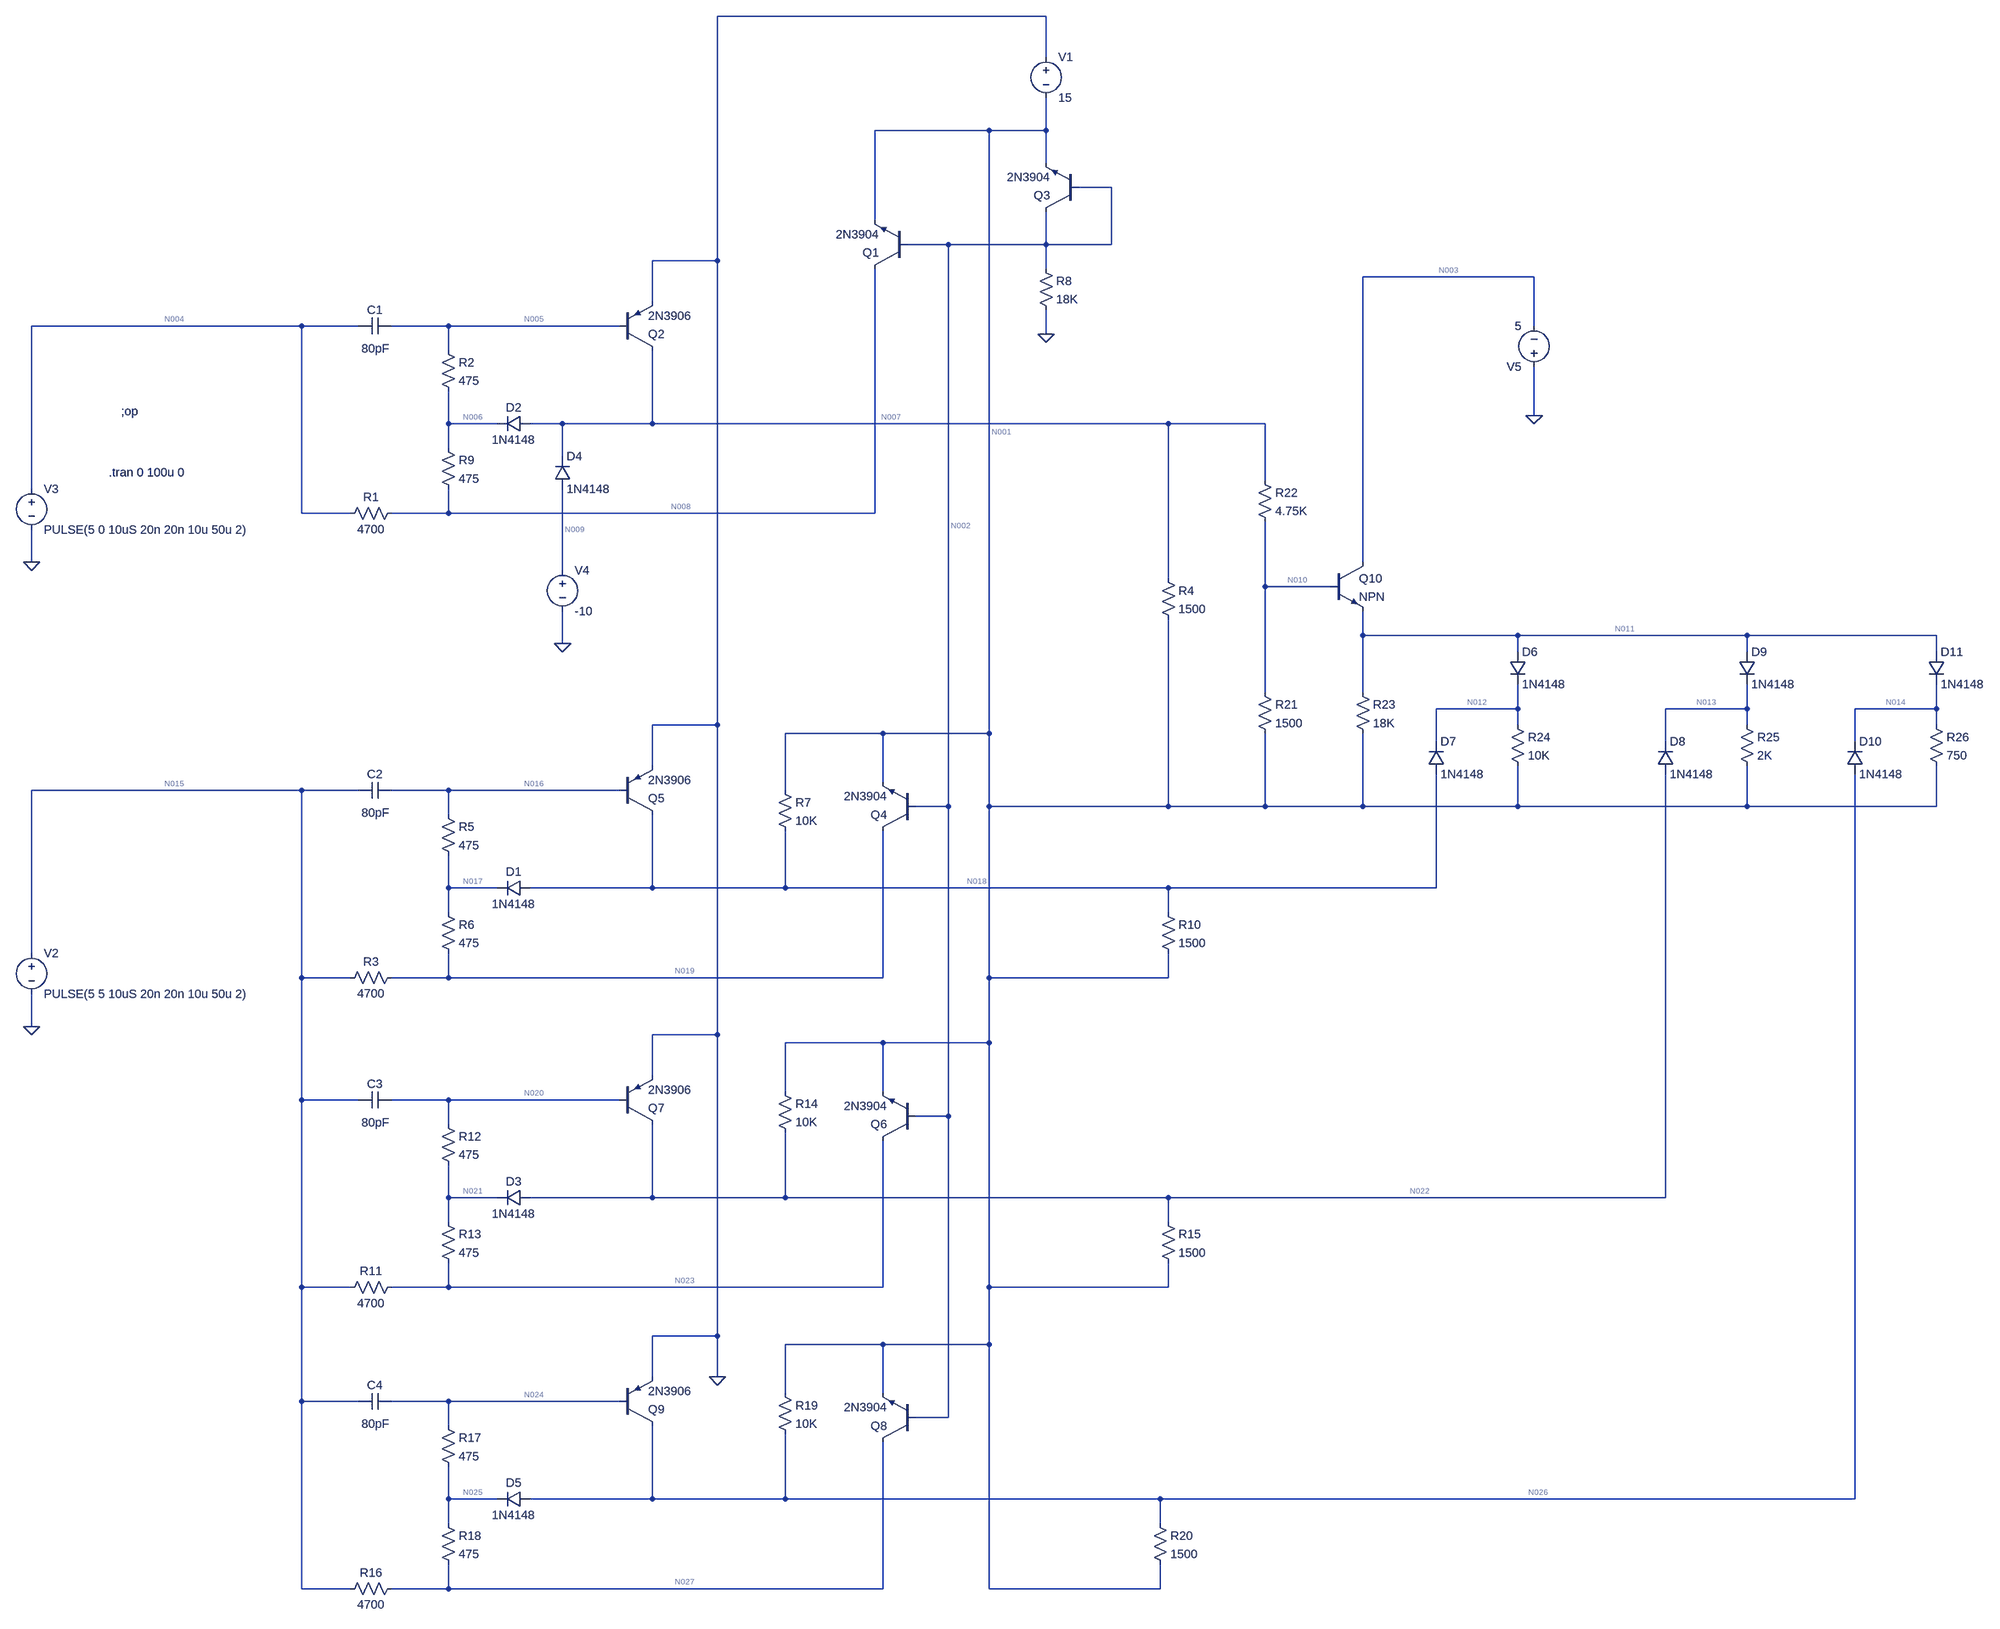
[diagram p0: schematic contra1579.asc]
contra1579.asc, the LTspice schematic file:
Version 4
SHEET 1 3744 3028
WIRE 1232 -784 512 -784
WIRE 1232 -704 1232 -784
WIRE 1120 -560 896 -560
WIRE 1232 -560 1232 -624
WIRE 1232 -560 1120 -560
WIRE 1232 -496 1232 -560
WIRE 1360 -448 1296 -448
WIRE 896 -384 896 -560
WIRE 1040 -336 960 -336
WIRE 1232 -336 1232 -400
WIRE 1232 -336 1040 -336
WIRE 1360 -336 1360 -448
WIRE 1360 -336 1232 -336
WIRE 512 -304 512 -784
WIRE 512 -304 384 -304
WIRE 1232 -288 1232 -336
WIRE 2208 -272 1872 -272
WIRE 384 -224 384 -304
WIRE -304 -176 -864 -176
WIRE -192 -176 -304 -176
WIRE -16 -176 -128 -176
WIRE 320 -176 -16 -176
WIRE 2208 -176 2208 -272
WIRE 1232 -160 1232 -208
WIRE -16 -128 -16 -176
WIRE 2208 0 2208 -96
WIRE -16 16 -16 -48
WIRE 80 16 -16 16
WIRE 208 16 144 16
WIRE 384 16 384 -128
WIRE 384 16 208 16
WIRE 1472 16 384 16
WIRE 1680 16 1472 16
WIRE -16 64 -16 16
WIRE 208 80 208 16
WIRE 1680 128 1680 16
WIRE -864 144 -864 -176
WIRE -304 192 -304 -176
WIRE -208 192 -304 192
WIRE -16 192 -16 144
WIRE -16 192 -128 192
WIRE 896 192 896 -288
WIRE 896 192 -16 192
WIRE -864 288 -864 224
WIRE 1872 288 1872 -272
WIRE 208 304 208 144
WIRE 1472 320 1472 16
WIRE 1680 336 1680 208
WIRE 1808 336 1680 336
WIRE 1872 432 1872 384
WIRE 2176 432 1872 432
WIRE 2656 432 2176 432
WIRE 3136 432 2656 432
WIRE 208 448 208 384
WIRE 2176 464 2176 432
WIRE 2656 464 2656 432
WIRE 3136 464 3136 432
WIRE 1680 544 1680 336
WIRE 1872 544 1872 432
WIRE 2176 576 2176 528
WIRE 2176 576 2016 576
WIRE 2656 576 2656 528
WIRE 2656 576 2496 576
WIRE 3136 576 3136 528
WIRE 3136 576 2976 576
WIRE 512 608 512 -304
WIRE 512 608 384 608
WIRE 2176 608 2176 576
WIRE 2656 608 2656 576
WIRE 3136 608 3136 576
WIRE 912 624 720 624
WIRE 1120 624 1120 -560
WIRE 1120 624 912 624
WIRE 2016 640 2016 576
WIRE 2496 640 2496 576
WIRE 2976 640 2976 576
WIRE 384 688 384 608
WIRE 912 720 912 624
WIRE -304 736 -864 736
WIRE -192 736 -304 736
WIRE -16 736 -128 736
WIRE 320 736 -16 736
WIRE 720 736 720 624
WIRE 1040 768 1040 -336
WIRE 1040 768 976 768
WIRE 1120 768 1120 624
WIRE 1472 768 1472 400
WIRE 1472 768 1120 768
WIRE 1680 768 1680 624
WIRE 1680 768 1472 768
WIRE 1872 768 1872 624
WIRE 1872 768 1680 768
WIRE 2176 768 2176 688
WIRE 2176 768 1872 768
WIRE 2656 768 2656 688
WIRE 2656 768 2176 768
WIRE 3136 768 3136 688
WIRE 3136 768 2656 768
WIRE -16 784 -16 736
WIRE -16 928 -16 864
WIRE 80 928 -16 928
WIRE 384 928 384 784
WIRE 384 928 144 928
WIRE 720 928 720 816
WIRE 720 928 384 928
WIRE 1472 928 720 928
WIRE 2016 928 2016 704
WIRE 2016 928 1472 928
WIRE -16 976 -16 928
WIRE 1472 976 1472 928
WIRE -864 1056 -864 736
WIRE -304 1104 -304 736
WIRE -208 1104 -304 1104
WIRE -16 1104 -16 1056
WIRE -16 1104 -128 1104
WIRE 912 1104 912 816
WIRE 912 1104 -16 1104
WIRE 1120 1104 1120 768
WIRE 1472 1104 1472 1056
WIRE 1472 1104 1120 1104
WIRE -864 1200 -864 1136
WIRE 512 1216 512 608
WIRE 512 1216 384 1216
WIRE 912 1232 720 1232
WIRE 1120 1232 1120 1104
WIRE 1120 1232 912 1232
WIRE 384 1296 384 1216
WIRE 720 1328 720 1232
WIRE 912 1328 912 1232
WIRE -304 1344 -304 1104
WIRE -192 1344 -304 1344
WIRE -16 1344 -128 1344
WIRE 320 1344 -16 1344
WIRE 1040 1376 1040 768
WIRE 1040 1376 976 1376
WIRE -16 1392 -16 1344
WIRE -16 1536 -16 1472
WIRE 80 1536 -16 1536
WIRE 384 1536 384 1392
WIRE 384 1536 144 1536
WIRE 720 1536 720 1408
WIRE 720 1536 384 1536
WIRE 1472 1536 720 1536
WIRE 2496 1536 2496 704
WIRE 2496 1536 1472 1536
WIRE -16 1584 -16 1536
WIRE 1472 1584 1472 1536
WIRE -304 1712 -304 1344
WIRE -208 1712 -304 1712
WIRE -16 1712 -16 1664
WIRE -16 1712 -128 1712
WIRE 912 1712 912 1424
WIRE 912 1712 -16 1712
WIRE 1120 1712 1120 1232
WIRE 1472 1712 1472 1664
WIRE 1472 1712 1120 1712
WIRE 512 1808 512 1216
WIRE 512 1808 384 1808
WIRE 912 1824 720 1824
WIRE 1120 1824 1120 1712
WIRE 1120 1824 912 1824
WIRE 384 1888 384 1808
WIRE 512 1888 512 1808
WIRE 720 1920 720 1824
WIRE 912 1920 912 1824
WIRE -304 1936 -304 1712
WIRE -192 1936 -304 1936
WIRE -16 1936 -128 1936
WIRE 320 1936 -16 1936
WIRE 1040 1968 1040 1376
WIRE 1040 1968 976 1968
WIRE -16 1984 -16 1936
WIRE -16 2128 -16 2064
WIRE 80 2128 -16 2128
WIRE 384 2128 384 1984
WIRE 384 2128 144 2128
WIRE 720 2128 720 2000
WIRE 720 2128 384 2128
WIRE 1456 2128 720 2128
WIRE 2976 2128 2976 704
WIRE 2976 2128 1456 2128
WIRE -16 2176 -16 2128
WIRE 1456 2176 1456 2128
WIRE -304 2304 -304 1936
WIRE -208 2304 -304 2304
WIRE -16 2304 -16 2256
WIRE -16 2304 -128 2304
WIRE 912 2304 912 2016
WIRE 912 2304 -16 2304
WIRE 1120 2304 1120 1824
WIRE 1456 2304 1456 2256
WIRE 1456 2304 1120 2304
FLAG -864 288 0
FLAG 1232 -160 0
FLAG 208 448 0
FLAG -864 1200 0
FLAG 512 1888 0
FLAG 2208 0 0
DATAFLAG 800 192 ""
SYMBOL cap -128 -192 R90
WINDOW 0 0 32 VBottom 2
WINDOW 3 45 31 VTop 2
SYMATTR InstName C1
SYMATTR Value 80pF
SYMBOL pnp 320 -128 M180
SYMATTR InstName Q2
SYMATTR Value 2N3906
SYMBOL voltage 1232 -720 R0
WINDOW 123 0 0 Left 2
WINDOW 39 0 0 Left 2
SYMATTR InstName V1
SYMATTR Value 15
SYMBOL voltage -864 128 R0
WINDOW 123 0 0 Left 2
WINDOW 39 0 0 Left 2
SYMATTR InstName V3
SYMATTR Value PULSE(5 0 10uS 20n 20n 10u 50u 2)
SYMBOL res 1216 -304 R0
SYMATTR InstName R8
SYMATTR Value 18K
SYMBOL res -112 176 R90
WINDOW 0 0 56 VBottom 2
WINDOW 3 32 56 VTop 2
SYMATTR InstName R1
SYMATTR Value 4700
SYMBOL res -32 -144 R0
SYMATTR InstName R2
SYMATTR Value 475
SYMBOL res -32 48 R0
SYMATTR InstName R9
SYMATTR Value 475
SYMBOL diode 144 32 M270
WINDOW 0 32 32 VTop 2
WINDOW 3 0 32 VBottom 2
SYMATTR InstName D2
SYMATTR Value 1N4148
SYMBOL diode 192 144 M180
WINDOW 0 24 64 Left 2
WINDOW 3 24 0 Left 2
SYMATTR InstName D4
SYMATTR Value 1N4148
SYMBOL voltage 208 288 R0
WINDOW 123 0 0 Left 2
WINDOW 39 0 0 Left 2
SYMATTR InstName V4
SYMATTR Value -10
SYMBOL npn 960 -288 R180
SYMATTR InstName Q1
SYMATTR Value 2N3904
SYMBOL npn 1296 -400 R180
SYMATTR InstName Q3
SYMATTR Value 2N3904
SYMBOL npn 976 816 R180
SYMATTR InstName Q4
SYMATTR Value 2N3904
SYMBOL cap -128 720 R90
WINDOW 0 0 32 VBottom 2
WINDOW 3 45 31 VTop 2
SYMATTR InstName C2
SYMATTR Value 80pF
SYMBOL voltage -864 1040 R0
WINDOW 123 0 0 Left 2
WINDOW 39 0 0 Left 2
SYMATTR InstName V2
SYMATTR Value PULSE(5 5 10uS 20n 20n 10u 50u 2)
SYMBOL res -112 1088 R90
WINDOW 0 0 56 VBottom 2
WINDOW 3 32 56 VTop 2
SYMATTR InstName R3
SYMATTR Value 4700
SYMBOL res -32 768 R0
SYMATTR InstName R5
SYMATTR Value 475
SYMBOL res -32 960 R0
SYMATTR InstName R6
SYMATTR Value 475
SYMBOL diode 144 944 M270
WINDOW 0 32 32 VTop 2
WINDOW 3 0 32 VBottom 2
SYMATTR InstName D1
SYMATTR Value 1N4148
SYMBOL pnp 320 784 M180
SYMATTR InstName Q5
SYMATTR Value 2N3906
SYMBOL res 704 720 R0
SYMATTR InstName R7
SYMATTR Value 10K
SYMBOL res 1456 960 R0
SYMATTR InstName R10
SYMATTR Value 1500
SYMBOL npn 976 1424 R180
SYMATTR InstName Q6
SYMATTR Value 2N3904
SYMBOL cap -128 1328 R90
WINDOW 0 0 32 VBottom 2
WINDOW 3 45 31 VTop 2
SYMATTR InstName C3
SYMATTR Value 80pF
SYMBOL res -112 1696 R90
WINDOW 0 0 56 VBottom 2
WINDOW 3 32 56 VTop 2
SYMATTR InstName R11
SYMATTR Value 4700
SYMBOL res -32 1376 R0
SYMATTR InstName R12
SYMATTR Value 475
SYMBOL res -32 1568 R0
SYMATTR InstName R13
SYMATTR Value 475
SYMBOL diode 144 1552 M270
WINDOW 0 32 32 VTop 2
WINDOW 3 0 32 VBottom 2
SYMATTR InstName D3
SYMATTR Value 1N4148
SYMBOL pnp 320 1392 M180
SYMATTR InstName Q7
SYMATTR Value 2N3906
SYMBOL res 704 1312 R0
SYMATTR InstName R14
SYMATTR Value 10K
SYMBOL res 1456 1568 R0
SYMATTR InstName R15
SYMATTR Value 1500
SYMBOL npn 976 2016 R180
SYMATTR InstName Q8
SYMATTR Value 2N3904
SYMBOL cap -128 1920 R90
WINDOW 0 0 32 VBottom 2
WINDOW 3 45 31 VTop 2
SYMATTR InstName C4
SYMATTR Value 80pF
SYMBOL res -112 2288 R90
WINDOW 0 0 56 VBottom 2
WINDOW 3 32 56 VTop 2
SYMATTR InstName R16
SYMATTR Value 4700
SYMBOL res -32 1968 R0
SYMATTR InstName R17
SYMATTR Value 475
SYMBOL res -32 2160 R0
SYMATTR InstName R18
SYMATTR Value 475
SYMBOL diode 144 2144 M270
WINDOW 0 32 32 VTop 2
WINDOW 3 0 32 VBottom 2
SYMATTR InstName D5
SYMATTR Value 1N4148
SYMBOL pnp 320 1984 M180
SYMATTR InstName Q9
SYMATTR Value 2N3906
SYMBOL res 704 1904 R0
SYMATTR InstName R19
SYMATTR Value 10K
SYMBOL res 1440 2160 R0
SYMATTR InstName R20
SYMATTR Value 1500
SYMBOL npn 1808 288 R0
SYMATTR InstName Q10
SYMBOL res 1664 528 R0
SYMATTR InstName R21
SYMATTR Value 1500
SYMBOL res 1664 112 R0
SYMATTR InstName R22
SYMATTR Value 4.75K
SYMBOL res 1456 304 R0
SYMATTR InstName R4
SYMATTR Value 1500
SYMBOL res 1856 528 R0
SYMATTR InstName R23
SYMATTR Value 18K
SYMBOL voltage 2208 -80 R180
WINDOW 123 0 0 Left 2
WINDOW 39 0 0 Left 2
SYMATTR InstName V5
SYMATTR Value 5
SYMBOL diode 2160 464 R0
SYMATTR InstName D6
SYMATTR Value 1N4148
SYMBOL res 2160 592 R0
SYMATTR InstName R24
SYMATTR Value 10K
SYMBOL diode 2000 704 M180
WINDOW 0 24 64 Left 2
WINDOW 3 24 0 Left 2
SYMATTR InstName D7
SYMATTR Value 1N4148
SYMBOL res 2640 592 R0
SYMATTR InstName R25
SYMATTR Value 2K
SYMBOL diode 2480 704 M180
WINDOW 0 24 64 Left 2
WINDOW 3 24 0 Left 2
SYMATTR InstName D8
SYMATTR Value 1N4148
SYMBOL diode 2640 464 R0
SYMATTR InstName D9
SYMATTR Value 1N4148
SYMBOL res 3120 592 R0
SYMATTR InstName R26
SYMATTR Value 750
SYMBOL diode 2960 704 M180
WINDOW 0 24 64 Left 2
WINDOW 3 24 0 Left 2
SYMATTR InstName D10
SYMATTR Value 1N4148
SYMBOL diode 3120 464 R0
SYMATTR InstName D11
SYMATTR Value 1N4148
TEXT -688 -8 Left 2 !;op
TEXT -712 112 Left 2 !.tran 0 100u 0

The netlist it stands for:
* contra1579.asc
C1 N005 N004 80pF
Q2 N007 N005 0 0 2N3906
V1 0 N001 15
V3 N004 0 PULSE(5 0 10uS 20n 20n 10u 50u 2)
R8 N002 0 18K
R1 N008 N004 4700
R2 N005 N006 475
R9 N006 N008 475
D2 N007 N006 1N4148
D4 N009 N007 1N4148
V4 N009 0 -10
Q1 N008 N002 N001 0 2N3904
Q3 N002 N002 N001 0 2N3904
Q4 N019 N002 N001 0 2N3904
C2 N016 N015 80pF
V2 N015 0 PULSE(5 5 10uS 20n 20n 10u 50u 2)
R3 N019 N015 4700
R5 N016 N017 475
R6 N017 N019 475
D1 N018 N017 1N4148
Q5 N018 N016 0 0 2N3906
R7 N001 N018 10K
R10 N018 N001 1500
Q6 N023 N002 N001 0 2N3904
C3 N020 N015 80pF
R11 N023 N015 4700
R12 N020 N021 475
R13 N021 N023 475
D3 N022 N021 1N4148
Q7 N022 N020 0 0 2N3906
R14 N001 N022 10K
R15 N022 N001 1500
Q8 N027 N002 N001 0 2N3904
C4 N024 N015 80pF
R16 N027 N015 4700
R17 N024 N025 475
R18 N025 N027 475
D5 N026 N025 1N4148
Q9 N026 N024 0 0 2N3906
R19 N001 N026 10K
R20 N026 N001 1500
Q10 N003 N010 N011 0 NPN
R21 N010 N001 1500
R22 N007 N010 4.75K
R4 N007 N001 1500
R23 N011 N001 18K
V5 0 N003 5
D6 N011 N012 1N4148
R24 N012 N001 10K
D7 N018 N012 1N4148
R25 N013 N001 2K
D8 N022 N013 1N4148
D9 N011 N013 1N4148
R26 N014 N001 750
D10 N026 N014 1N4148
D11 N011 N014 1N4148
.model D D
.lib standard.dio
.model NPN NPN
.model PNP PNP
.lib standard.bjt
;op
.tran 0 100u 0
.backanno
.end

* Results of the author's LTspice run, read from the files saved beside the schematic
* Operating Point, zero values left out:
*   V(n005) = 759.3 mV
*   V(n004) = 5 V
*   V(n007) = -10.64 V
*   V(n001) = -15 V
*   V(n002) = -14.35 V
*   V(n008) = 759.3 mV
*   V(n006) = 759.3 mV
*   V(n009) = -10 V
*   V(n019) = 759.3 mV
*   V(n016) = 759.3 mV
*   V(n015) = 5 V
*   V(n017) = 759.3 mV
*   V(n018) = -15 V
*   V(n023) = 759.3 mV
*   V(n020) = 759.3 mV
*   V(n021) = 759.3 mV
*   V(n022) = -15 V
*   V(n027) = 759.3 mV
*   V(n024) = 759.3 mV
*   V(n025) = 759.3 mV
*   V(n026) = -15 V
*   V(n003) = -5 V
*   V(n010) = -13.96 V
*   V(n011) = -14.64 V
*   V(n012) = -14.97 V
*   V(n013) = -14.99 V
*   V(n014) = -15 V
*   Ic(Q10) = 34.32 µA
*   Ib(Q10) = 343.2 nA
*   Ie(Q10) = -34.67 µA
*   Ic(Q8) = 902.3 µA
*   Ib(Q8) = 2.618 µA
*   Ie(Q8) = -904.9 µA
*   Ic(Q6) = 902.3 µA
*   Ib(Q6) = 2.618 µA
*   Ie(Q6) = -904.9 µA
*   Ic(Q4) = 902.3 µA
*   Ib(Q4) = 2.618 µA
*   Ie(Q4) = -904.9 µA
*   Ic(Q3) = 784.2 µA
*   Ib(Q3) = 2.619 µA
*   Ie(Q3) = -786.8 µA
*   Ic(Q1) = 902.3 µA
*   Ib(Q1) = 2.618 µA
*   Ie(Q1) = -904.9 µA
*   Ic(Q9) = -15.77 pA
*   Ib(Q9) = 16.52 pA
*   Ic(Q7) = -15.77 pA
*   Ib(Q7) = 16.52 pA
*   Ic(Q5) = -15.77 pA
*   Ib(Q5) = 16.52 pA
*   Ic(Q2) = -11.4 pA
*   Ib(Q2) = 12.17 pA
*   I(D11) = 6.134 µA
*   I(D10) = -243.1 pA
*   I(D9) = 5.359 µA
*   I(D8) = -530.6 pA
*   I(D7) = -1.3 nA
*   I(D6) = 3.287 µA
*   I(D5) = -2.536 nA
*   I(D3) = -2.536 nA
*   I(D1) = -2.536 nA
*   I(D4) = 3.601 mA
*   I(D2) = -2.531 nA
*   I(R26) = 6.134 µA
*   I(R25) = 5.359 µA
*   I(R24) = 3.286 µA
*   I(R23) = 19.89 µA
*   I(R4) = 2.904 mA
*   I(R22) = 697 µA
*   I(R21) = 696.7 µA
*   I(R20) = 2.43 nA
*   I(R19) = -364.5 pA
*   I(R18) = -2.552 nA
*   I(R17) = -16.52 pA
*   I(R16) = -902.3 µA
*   I(R15) = 2.68 nA
*   I(R14) = -402 pA
*   I(R13) = -2.552 nA
*   I(R12) = -16.52 pA
*   I(R11) = -902.3 µA
*   I(R10) = 3.349 nA
*   I(R7) = -502.3 pA
*   I(R6) = -2.552 nA
*   I(R5) = -16.52 pA
*   I(R3) = -902.3 µA
*   I(R9) = -2.544 nA
*   I(R2) = -12.17 pA
*   I(R1) = -902.3 µA
*   I(R8) = -797.3 µA
*   I(V5) = 34.32 µA
*   I(V2) = -2.707 mA
*   I(V4) = -3.601 mA
*   I(V3) = -902.3 µA
*   I(V1) = -8.042 mA
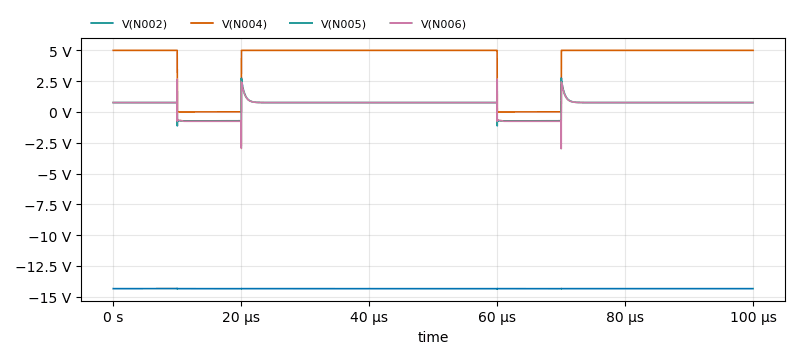
[diagram p1: Transient Analysis of contra1579.asc, plotted from the saved traces]
* Transient Analysis, 1 run:
*   V(N002): min -14.36 V, max -14.34 V, average -14.35 V, rms 14.35 V, last -14.35 V
*   V(N004): min 0 V, max 5 V, average 3.998 V, rms 4.471 V, last 5 V
*   V(N005): min -1.129 V, max 2.755 V, average 481.6 mV, rms 784.5 mV, last 759.3 mV
*   V(N006): min -2.986 V, max 2.676 V, average 474.4 mV, rms 785.9 mV, last 759.3 mV